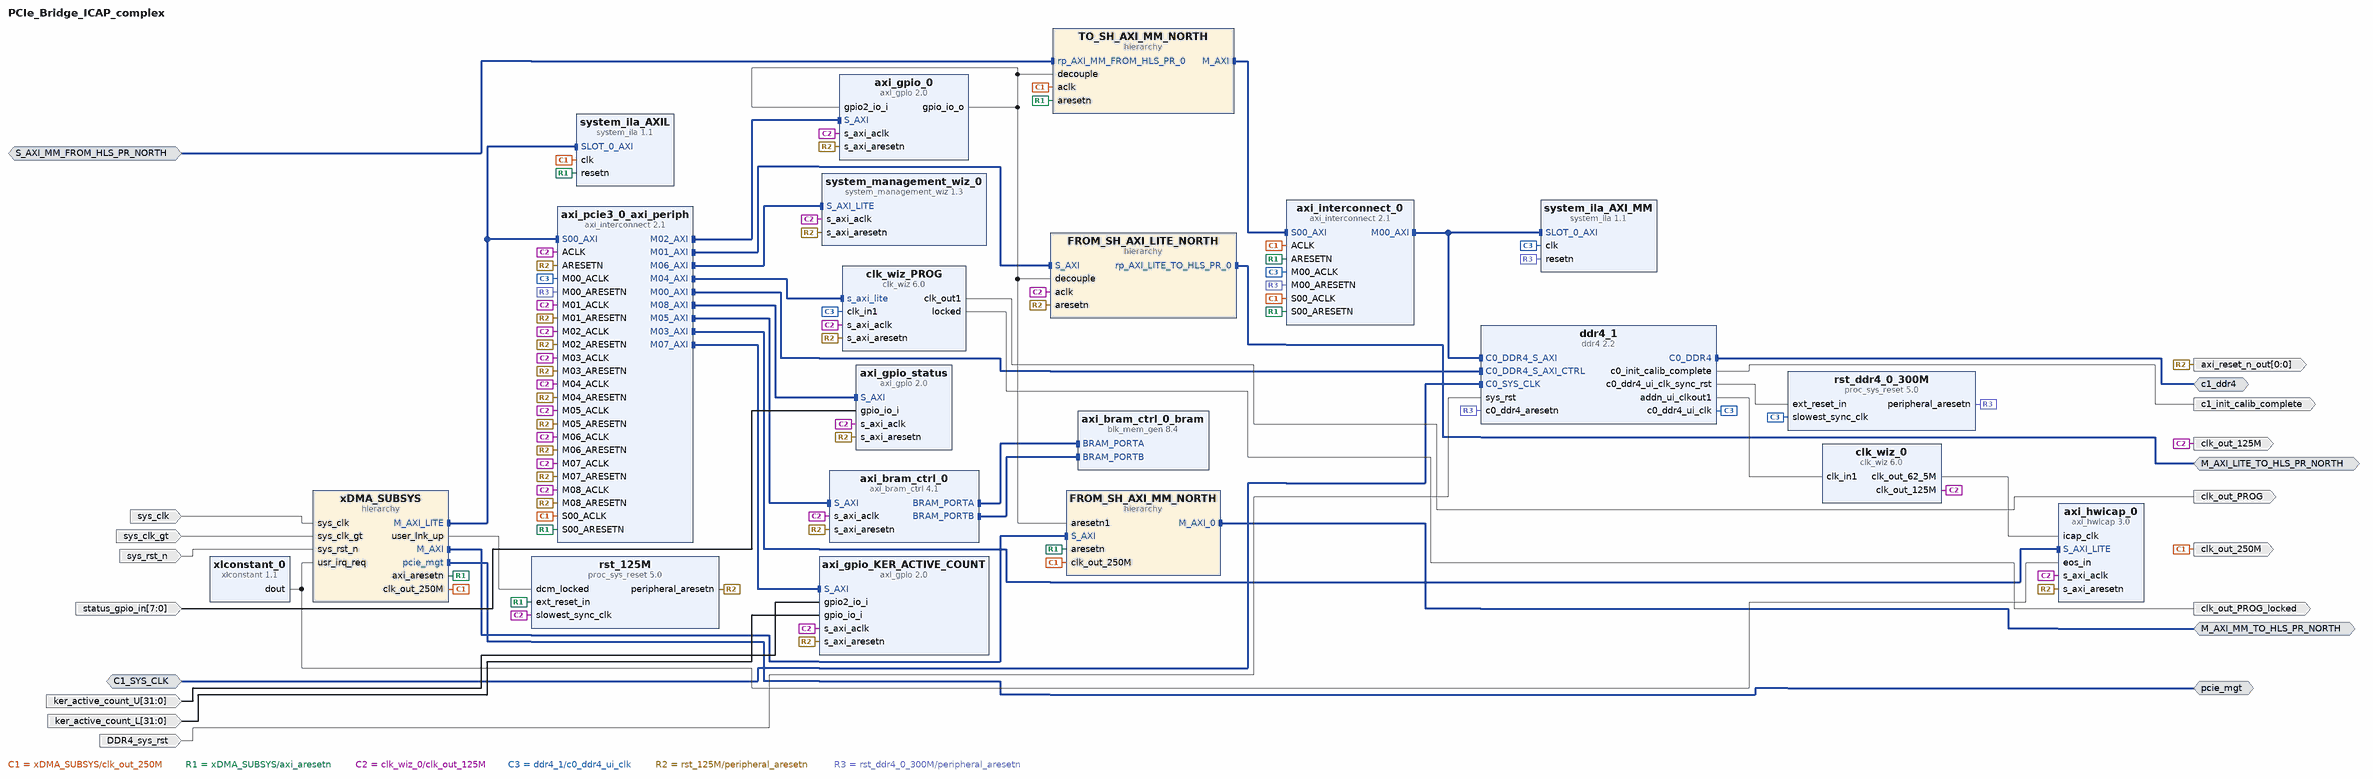
[diagram p0: block diagram of the top level]
# Vivado block design PCIe_Bridge_ICAP_complex, xcvu9p-fsgd2104-2-i, Vivado 2019.1
create_bd_design PCIe_Bridge_ICAP_complex

create_bd_intf_port -mode Slave -vlnv xilinx.com:interface:diff_clock_rtl:1.0 C1_SYS_CLK
set_property -dict {CONFIG.FREQ_HZ 300000000} [get_bd_intf_ports C1_SYS_CLK]
create_bd_intf_port -mode Master -vlnv xilinx.com:interface:aximm_rtl:1.0 M_AXI_LITE_TO_HLS_PR_NORTH
set_property -dict [list \
  CONFIG.ADDR_WIDTH 32 \
  CONFIG.DATA_WIDTH 32 \
  CONFIG.HAS_BURST 0 \
  CONFIG.HAS_QOS 0 \
  CONFIG.HAS_REGION 0 \
  CONFIG.PROTOCOL AXI4LITE \
] [get_bd_intf_ports M_AXI_LITE_TO_HLS_PR_NORTH]
create_bd_intf_port -mode Master -vlnv xilinx.com:interface:aximm_rtl:1.0 M_AXI_MM_TO_HLS_PR_NORTH
set_property -dict [list \
  CONFIG.ADDR_WIDTH 64 \
  CONFIG.DATA_WIDTH 512 \
  CONFIG.NUM_READ_OUTSTANDING 32 \
  CONFIG.NUM_WRITE_OUTSTANDING 32 \
  CONFIG.PROTOCOL AXI4 \
] [get_bd_intf_ports M_AXI_MM_TO_HLS_PR_NORTH]
create_bd_intf_port -mode Slave -vlnv xilinx.com:interface:aximm_rtl:1.0 S_AXI_MM_FROM_HLS_PR_NORTH
set_property -dict [list \
  CONFIG.ADDR_WIDTH 64 \
  CONFIG.ARUSER_WIDTH 0 \
  CONFIG.AWUSER_WIDTH 0 \
  CONFIG.BUSER_WIDTH 0 \
  CONFIG.DATA_WIDTH 512 \
  CONFIG.HAS_BRESP 1 \
  CONFIG.HAS_BURST 1 \
  CONFIG.HAS_CACHE 1 \
  CONFIG.HAS_LOCK 1 \
  CONFIG.HAS_PROT 1 \
  CONFIG.HAS_QOS 1 \
  CONFIG.HAS_REGION 1 \
  CONFIG.HAS_RRESP 1 \
  CONFIG.HAS_WSTRB 1 \
  CONFIG.ID_WIDTH 5 \
  CONFIG.MAX_BURST_LENGTH 256 \
  CONFIG.NUM_READ_OUTSTANDING 32 \
  CONFIG.NUM_READ_THREADS 1 \
  CONFIG.NUM_WRITE_OUTSTANDING 32 \
  CONFIG.NUM_WRITE_THREADS 1 \
  CONFIG.PROTOCOL AXI4 \
  CONFIG.READ_WRITE_MODE READ_WRITE \
  CONFIG.RUSER_BITS_PER_BYTE 0 \
  CONFIG.RUSER_WIDTH 0 \
  CONFIG.SUPPORTS_NARROW_BURST 1 \
  CONFIG.WUSER_BITS_PER_BYTE 0 \
  CONFIG.WUSER_WIDTH 0 \
] [get_bd_intf_ports S_AXI_MM_FROM_HLS_PR_NORTH]
create_bd_intf_port -mode Master -vlnv xilinx.com:interface:ddr4_rtl:1.0 c1_ddr4
create_bd_intf_port -mode Master -vlnv xilinx.com:interface:pcie_7x_mgt_rtl:1.0 pcie_mgt
create_bd_port -dir I -type rst DDR4_sys_rst
set_property -dict {CONFIG.POLARITY ACTIVE_HIGH} [get_bd_ports DDR4_sys_rst]
create_bd_port -dir O -from 0 -to 0 -type rst axi_reset_n_out
create_bd_port -dir O c1_init_calib_complete
create_bd_port -dir O -type clk clk_out_125M
set_property -dict [list \
  CONFIG.ASSOCIATED_BUSIF M_AXI_LITE_TO_HLS_PR_NORTH \
  CONFIG.ASSOCIATED_RESET axi_reset_n_out \
] [get_bd_ports clk_out_125M]
create_bd_port -dir O -type clk clk_out_250M
set_property -dict {CONFIG.ASSOCIATED_BUSIF S_AXI_MM_FROM_HLS_PR_NORTH:M_AXI_MM_TO_HLS_PR_NORTH} [get_bd_ports clk_out_250M]
create_bd_port -dir O -type clk clk_out_PROG
set_property -dict {CONFIG.FREQ_HZ 400000000} [get_bd_ports clk_out_PROG]
create_bd_port -dir O clk_out_PROG_locked
create_bd_port -dir I -from 31 -to 0 ker_active_count_L
create_bd_port -dir I -from 31 -to 0 ker_active_count_U
create_bd_port -dir I -from 7 -to 0 status_gpio_in
create_bd_port -dir I -type clk sys_clk
create_bd_port -dir I -type clk sys_clk_gt
create_bd_port -dir I -type rst sys_rst_n

create_bd_cell -type hier FROM_SH_AXI_LITE_NORTH
create_bd_cell -type hier FROM_SH_AXI_MM_NORTH
create_bd_cell -type hier TO_SH_AXI_MM_NORTH
create_bd_cell -type ip -vlnv xilinx.com:ip:axi_bram_ctrl:4.1 axi_bram_ctrl_0
create_bd_cell -type ip -vlnv xilinx.com:ip:blk_mem_gen:8.4 axi_bram_ctrl_0_bram
set_property -dict [list \
  CONFIG.Enable_B Use_ENB_Pin \
  CONFIG.Memory_Type True_Dual_Port_RAM \
  CONFIG.Port_B_Clock 100 \
  CONFIG.Port_B_Enable_Rate 100 \
  CONFIG.Port_B_Write_Rate 50 \
  CONFIG.Use_RSTB_Pin true \
] [get_bd_cells axi_bram_ctrl_0_bram]
create_bd_cell -type ip -vlnv xilinx.com:ip:axi_gpio:2.0 axi_gpio_0
set_property -dict [list \
  CONFIG.C_ALL_INPUTS_2 1 \
  CONFIG.C_ALL_OUTPUTS 1 \
  CONFIG.C_GPIO2_WIDTH 1 \
  CONFIG.C_GPIO_WIDTH 1 \
  CONFIG.C_IS_DUAL 1 \
] [get_bd_cells axi_gpio_0]
create_bd_cell -type ip -vlnv xilinx.com:ip:axi_gpio:2.0 axi_gpio_KER_ACTIVE_COUNT
set_property -dict {CONFIG.C_ALL_INPUTS 1 CONFIG.C_ALL_INPUTS_2 1 CONFIG.C_IS_DUAL 1} [get_bd_cells axi_gpio_KER_ACTIVE_COUNT]
create_bd_cell -type ip -vlnv xilinx.com:ip:axi_gpio:2.0 axi_gpio_status
set_property -dict {CONFIG.C_ALL_INPUTS 1 CONFIG.C_GPIO_WIDTH 8} [get_bd_cells axi_gpio_status]
create_bd_cell -type ip -vlnv xilinx.com:ip:axi_hwicap:3.0 axi_hwicap_0
set_property -dict {CONFIG.C_FAMILY kintexu} [get_bd_cells axi_hwicap_0]
create_bd_cell -type ip -vlnv xilinx.com:ip:axi_interconnect:2.1 axi_interconnect_0
set_property -dict [list \
  CONFIG.M00_HAS_DATA_FIFO 0 \
  CONFIG.M00_HAS_REGSLICE 4 \
  CONFIG.M01_HAS_REGSLICE 4 \
  CONFIG.NUM_MI 1 \
  CONFIG.NUM_SI 1 \
  CONFIG.S00_HAS_DATA_FIFO 0 \
  CONFIG.S00_HAS_REGSLICE 4 \
  CONFIG.S01_HAS_DATA_FIFO 0 \
  CONFIG.S01_HAS_REGSLICE 4 \
  CONFIG.S02_HAS_DATA_FIFO 0 \
  CONFIG.S02_HAS_REGSLICE 4 \
  CONFIG.S03_HAS_DATA_FIFO 0 \
  CONFIG.S03_HAS_REGSLICE 4 \
  CONFIG.SYNCHRONIZATION_STAGES 2 \
] [get_bd_cells axi_interconnect_0]
create_bd_cell -type ip -vlnv xilinx.com:ip:axi_interconnect:2.1 axi_pcie3_0_axi_periph
set_property -dict [list \
  CONFIG.M00_HAS_REGSLICE 4 \
  CONFIG.M01_HAS_REGSLICE 4 \
  CONFIG.M02_HAS_REGSLICE 4 \
  CONFIG.M03_HAS_REGSLICE 4 \
  CONFIG.M04_HAS_REGSLICE 4 \
  CONFIG.M05_HAS_REGSLICE 4 \
  CONFIG.M06_HAS_REGSLICE 4 \
  CONFIG.M07_HAS_REGSLICE 4 \
  CONFIG.M08_HAS_REGSLICE 4 \
  CONFIG.NUM_MI 9 \
  CONFIG.S00_HAS_REGSLICE 4 \
  CONFIG.SYNCHRONIZATION_STAGES 2 \
] [get_bd_cells axi_pcie3_0_axi_periph]
create_bd_cell -type ip -vlnv xilinx.com:ip:clk_wiz:6.0 clk_wiz_0
set_property -dict [list \
  CONFIG.CLKIN1_JITTER_PS 40.0 \
  CONFIG.CLKOUT1_DRIVES BUFG \
  CONFIG.CLKOUT1_JITTER 88.976 \
  CONFIG.CLKOUT1_PHASE_ERROR 71.064 \
  CONFIG.CLKOUT1_REQUESTED_OUT_FREQ 125.000 \
  CONFIG.CLKOUT2_DRIVES BUFG \
  CONFIG.CLKOUT2_JITTER 101.705 \
  CONFIG.CLKOUT2_PHASE_ERROR 71.064 \
  CONFIG.CLKOUT2_REQUESTED_OUT_FREQ 62.5 \
  CONFIG.CLKOUT2_USED true \
  CONFIG.CLKOUT3_DRIVES Buffer \
  CONFIG.CLKOUT3_JITTER 79.446 \
  CONFIG.CLKOUT3_PHASE_ERROR 72.667 \
  CONFIG.CLKOUT3_REQUESTED_OUT_FREQ 100.000 \
  CONFIG.CLKOUT3_USED false \
  CONFIG.CLKOUT4_DRIVES Buffer \
  CONFIG.CLKOUT5_DRIVES Buffer \
  CONFIG.CLKOUT6_DRIVES Buffer \
  CONFIG.CLKOUT7_DRIVES Buffer \
  CONFIG.CLK_OUT1_PORT clk_out_125M \
  CONFIG.CLK_OUT2_PORT clk_out_62_5M \
  CONFIG.CLK_OUT3_PORT clk_out3 \
  CONFIG.FEEDBACK_SOURCE FDBK_AUTO \
  CONFIG.JITTER_SEL Min_O_Jitter \
  CONFIG.MMCM_BANDWIDTH HIGH \
  CONFIG.MMCM_CLKFBOUT_MULT_F 6.250 \
  CONFIG.MMCM_CLKIN1_PERIOD 4.000 \
  CONFIG.MMCM_CLKIN2_PERIOD 10.0 \
  CONFIG.MMCM_CLKOUT0_DIVIDE_F 12.500 \
  CONFIG.MMCM_CLKOUT1_DIVIDE 25 \
  CONFIG.MMCM_CLKOUT2_DIVIDE 1 \
  CONFIG.MMCM_DIVCLK_DIVIDE 1 \
  CONFIG.NUM_OUT_CLKS 2 \
  CONFIG.PHASESHIFT_MODE WAVEFORM \
  CONFIG.PRIM_SOURCE No_buffer \
  CONFIG.SECONDARY_SOURCE Single_ended_clock_capable_pin \
  CONFIG.USE_FREQ_SYNTH true \
  CONFIG.USE_LOCKED false \
  CONFIG.USE_PHASE_ALIGNMENT false \
  CONFIG.USE_RESET false \
] [get_bd_cells clk_wiz_0]
create_bd_cell -type ip -vlnv xilinx.com:ip:clk_wiz:6.0 clk_wiz_PROG
set_property -dict [list \
  CONFIG.CLKIN1_JITTER_PS 33.330000000000005 \
  CONFIG.CLKOUT1_DRIVES Buffer \
  CONFIG.CLKOUT1_JITTER 71.763 \
  CONFIG.CLKOUT1_PHASE_ERROR 75.042 \
  CONFIG.CLKOUT1_REQUESTED_OUT_FREQ 400.000 \
  CONFIG.CLKOUT2_DRIVES Buffer \
  CONFIG.CLKOUT3_DRIVES Buffer \
  CONFIG.CLKOUT4_DRIVES Buffer \
  CONFIG.CLKOUT5_DRIVES Buffer \
  CONFIG.CLKOUT6_DRIVES Buffer \
  CONFIG.CLKOUT7_DRIVES Buffer \
  CONFIG.JITTER_SEL Min_O_Jitter \
  CONFIG.MMCM_BANDWIDTH HIGH \
  CONFIG.MMCM_CLKFBOUT_MULT_F 15.500 \
  CONFIG.MMCM_CLKIN1_PERIOD 3.333 \
  CONFIG.MMCM_CLKIN2_PERIOD 10.0 \
  CONFIG.MMCM_CLKOUT0_DIVIDE_F 3.875 \
  CONFIG.MMCM_DIVCLK_DIVIDE 3 \
  CONFIG.PRIM_SOURCE No_buffer \
  CONFIG.SECONDARY_SOURCE Single_ended_clock_capable_pin \
  CONFIG.USE_DYN_RECONFIG true \
  CONFIG.USE_PHASE_ALIGNMENT false \
] [get_bd_cells clk_wiz_PROG]
create_bd_cell -type ip -vlnv xilinx.com:ip:ddr4:2.2 ddr4_1
set_property -dict [list \
  CONFIG.ADDN_UI_CLKOUT1_FREQ_HZ 250 \
  CONFIG.C0.BANK_GROUP_WIDTH 2 \
  CONFIG.C0.CKE_WIDTH 1 \
  CONFIG.C0.CS_WIDTH 1 \
  CONFIG.C0.DDR4_AxiAddressWidth 34 \
  CONFIG.C0.DDR4_AxiDataWidth 512 \
  CONFIG.C0.DDR4_CasLatency 17 \
  CONFIG.C0.DDR4_CasWriteLatency 12 \
  CONFIG.C0.DDR4_DataWidth 72 \
  CONFIG.C0.DDR4_InputClockPeriod 3332 \
  CONFIG.C0.DDR4_MemoryPart MTA18ASF2G72PZ-2G3 \
  CONFIG.C0.DDR4_MemoryType RDIMMs \
  CONFIG.C0.DDR4_TimePeriod 833 \
  CONFIG.C0.ODT_WIDTH 1 \
] [get_bd_cells ddr4_1]
create_bd_cell -type ip -vlnv xilinx.com:ip:proc_sys_reset:5.0 rst_125M
create_bd_cell -type ip -vlnv xilinx.com:ip:proc_sys_reset:5.0 rst_ddr4_0_300M
create_bd_cell -type ip -vlnv xilinx.com:ip:system_ila:1.1 system_ila_AXIL
set_property -dict {CONFIG.C_MON_TYPE INTERFACE} [get_bd_cells system_ila_AXIL]
create_bd_cell -type ip -vlnv xilinx.com:ip:system_ila:1.1 system_ila_AXI_MM
set_property -dict [list \
  CONFIG.ALL_PROBE_SAME_MU true \
  CONFIG.C_INPUT_PIPE_STAGES 4 \
  CONFIG.C_MON_TYPE INTERFACE \
  CONFIG.C_SLOT_0_AXI_B_SEL_TRIG 0 \
  CONFIG.C_SLOT_0_AXI_R_SEL_TRIG 0 \
  CONFIG.C_SLOT_0_AXI_W_SEL_TRIG 0 \
  CONFIG.C_SLOT_0_MAX_RD_BURSTS 32 \
  CONFIG.C_SLOT_0_MAX_WR_BURSTS 32 \
  CONFIG.C_SLOT_0_TXN_CNTR_EN 0 \
] [get_bd_cells system_ila_AXI_MM]
create_bd_cell -type ip -vlnv xilinx.com:ip:system_management_wiz:1.3 system_management_wiz_0
set_property -dict [list \
  CONFIG.CHANNEL_ENABLE_VP_VN false \
  CONFIG.INTERFACE_SELECTION Enable_AXI \
  CONFIG.TEMPERATURE_ALARM_OT_TRIGGER 95.0 \
] [get_bd_cells system_management_wiz_0]
create_bd_cell -type hier xDMA_SUBSYS
create_bd_cell -type ip -vlnv xilinx.com:ip:xlconstant:1.1 xlconstant_0
set_property -dict {CONFIG.CONST_VAL 0} [get_bd_cells xlconstant_0]

# ---- hierarchy /FROM_SH_AXI_LITE_NORTH ----
current_bd_instance /FROM_SH_AXI_LITE_NORTH
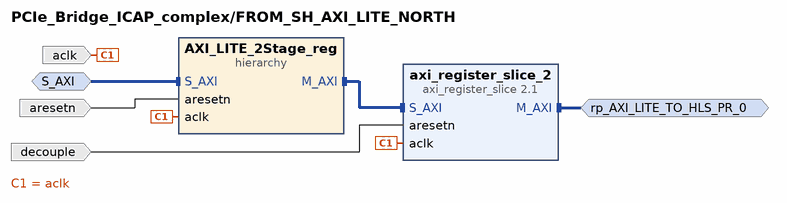
[diagram p1: block diagram inside /FROM_SH_AXI_LITE_NORTH]
create_bd_intf_pin -mode Slave -vlnv xilinx.com:interface:aximm_rtl:1.0 S_AXI
create_bd_intf_pin -mode Master -vlnv xilinx.com:interface:aximm_rtl:1.0 rp_AXI_LITE_TO_HLS_PR_0
create_bd_pin -dir I -type clk aclk
create_bd_pin -dir I -type rst aresetn
create_bd_pin -dir I decouple

create_bd_cell -type hier AXI_LITE_2Stage_reg
create_bd_cell -type ip -vlnv xilinx.com:ip:axi_register_slice:2.1 axi_register_slice_2
set_property -dict {CONFIG.REG_R 7 CONFIG.REG_W 7} [get_bd_cells axi_register_slice_2]

# ---- hierarchy /FROM_SH_AXI_LITE_NORTH/AXI_LITE_2Stage_reg ----
current_bd_instance /FROM_SH_AXI_LITE_NORTH/AXI_LITE_2Stage_reg
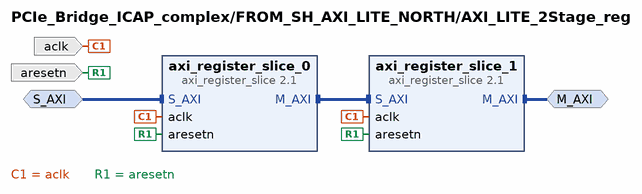
[diagram p2: block diagram inside /FROM_SH_AXI_LITE_NORTH/AXI_LITE_2Stage_reg]
create_bd_intf_pin -mode Master -vlnv xilinx.com:interface:aximm_rtl:1.0 M_AXI
create_bd_intf_pin -mode Slave -vlnv xilinx.com:interface:aximm_rtl:1.0 S_AXI
create_bd_pin -dir I -type clk aclk
create_bd_pin -dir I -type rst aresetn

create_bd_cell -type ip -vlnv xilinx.com:ip:axi_register_slice:2.1 axi_register_slice_0
set_property -dict {CONFIG.REG_R 7 CONFIG.REG_W 7} [get_bd_cells axi_register_slice_0]
create_bd_cell -type ip -vlnv xilinx.com:ip:axi_register_slice:2.1 axi_register_slice_1
set_property -dict {CONFIG.REG_R 7 CONFIG.REG_W 7} [get_bd_cells axi_register_slice_1]

# ---- hierarchy /FROM_SH_AXI_MM_NORTH ----
current_bd_instance /FROM_SH_AXI_MM_NORTH
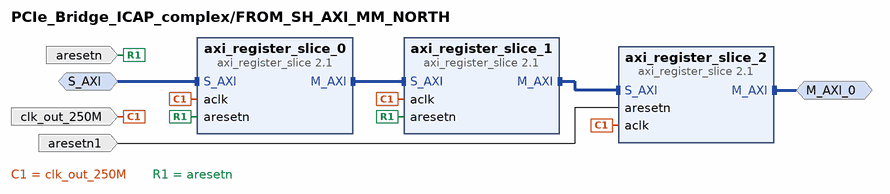
[diagram p3: block diagram inside /FROM_SH_AXI_MM_NORTH]
create_bd_intf_pin -mode Master -vlnv xilinx.com:interface:aximm_rtl:1.0 M_AXI_0
create_bd_intf_pin -mode Slave -vlnv xilinx.com:interface:aximm_rtl:1.0 S_AXI
create_bd_pin -dir I -type rst aresetn
create_bd_pin -dir I -type rst aresetn1
create_bd_pin -dir I -type clk clk_out_250M

create_bd_cell -type ip -vlnv xilinx.com:ip:axi_register_slice:2.1 axi_register_slice_0
create_bd_cell -type ip -vlnv xilinx.com:ip:axi_register_slice:2.1 axi_register_slice_1
create_bd_cell -type ip -vlnv xilinx.com:ip:axi_register_slice:2.1 axi_register_slice_2

# ---- hierarchy /TO_SH_AXI_MM_NORTH ----
current_bd_instance /TO_SH_AXI_MM_NORTH
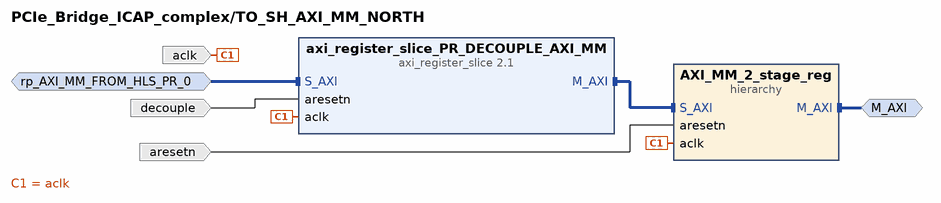
[diagram p4: block diagram inside /TO_SH_AXI_MM_NORTH]
create_bd_intf_pin -mode Master -vlnv xilinx.com:interface:aximm_rtl:1.0 M_AXI
create_bd_intf_pin -mode Slave -vlnv xilinx.com:interface:aximm_rtl:1.0 rp_AXI_MM_FROM_HLS_PR_0
create_bd_pin -dir I -type clk aclk
create_bd_pin -dir I -type rst aresetn
create_bd_pin -dir I decouple

create_bd_cell -type hier AXI_MM_2_stage_reg
create_bd_cell -type ip -vlnv xilinx.com:ip:axi_register_slice:2.1 axi_register_slice_PR_DECOUPLE_AXI_MM

# ---- hierarchy /TO_SH_AXI_MM_NORTH/AXI_MM_2_stage_reg ----
current_bd_instance /TO_SH_AXI_MM_NORTH/AXI_MM_2_stage_reg
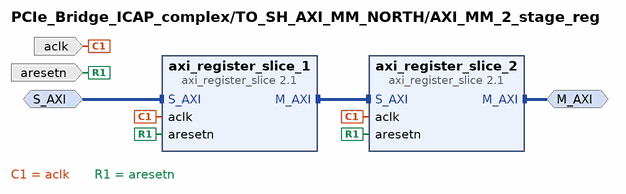
[diagram p5: block diagram inside /TO_SH_AXI_MM_NORTH/AXI_MM_2_stage_reg]
create_bd_intf_pin -mode Master -vlnv xilinx.com:interface:aximm_rtl:1.0 M_AXI
create_bd_intf_pin -mode Slave -vlnv xilinx.com:interface:aximm_rtl:1.0 S_AXI
create_bd_pin -dir I -type clk aclk
create_bd_pin -dir I -type rst aresetn

create_bd_cell -type ip -vlnv xilinx.com:ip:axi_register_slice:2.1 axi_register_slice_1
create_bd_cell -type ip -vlnv xilinx.com:ip:axi_register_slice:2.1 axi_register_slice_2

# ---- hierarchy /xDMA_SUBSYS ----
current_bd_instance /xDMA_SUBSYS
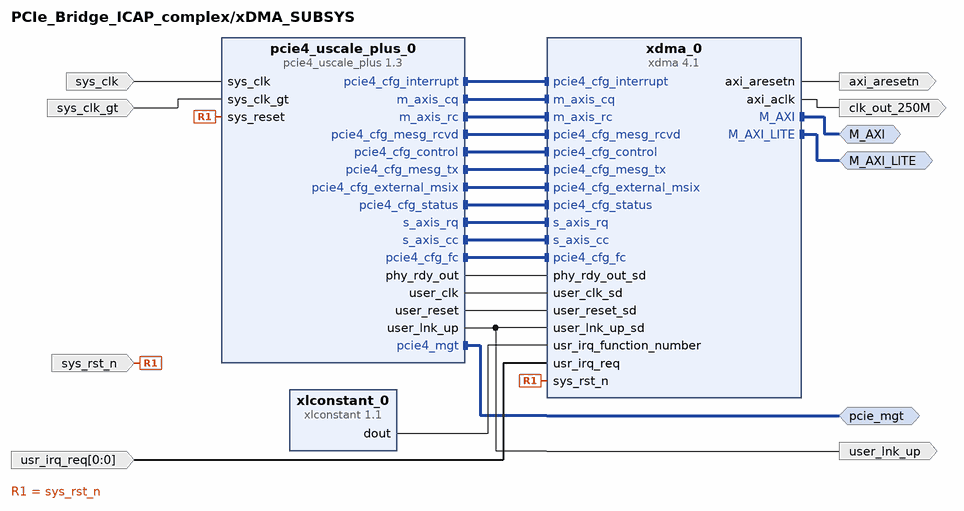
[diagram p6: block diagram inside /xDMA_SUBSYS]
create_bd_intf_pin -mode Master -vlnv xilinx.com:interface:aximm_rtl:1.0 M_AXI
create_bd_intf_pin -mode Master -vlnv xilinx.com:interface:aximm_rtl:1.0 M_AXI_LITE
create_bd_intf_pin -mode Master -vlnv xilinx.com:interface:pcie_7x_mgt_rtl:1.0 pcie_mgt
create_bd_pin -dir O -type rst axi_aresetn
create_bd_pin -dir O -type clk clk_out_250M
create_bd_pin -dir I -type clk sys_clk
create_bd_pin -dir I -type clk sys_clk_gt
create_bd_pin -dir I -type rst sys_rst_n
create_bd_pin -dir O user_lnk_up
create_bd_pin -dir I -from 0 -to 0 usr_irq_req

create_bd_cell -type ip -vlnv xilinx.com:ip:pcie4_uscale_plus:1.3 pcie4_uscale_plus_0
set_property -dict [list \
  CONFIG.AXISTEN_IF_CQ_ALIGNMENT_MODE Address_Aligned \
  CONFIG.AXISTEN_IF_EXT_512_RC_4TLP_STRADDLE true \
  CONFIG.AXISTEN_IF_EXT_512_RQ_STRADDLE true \
  CONFIG.MSI_X_OPTIONS MSI-X_External \
  CONFIG.PF0_DEVICE_ID 903F \
  CONFIG.PF0_MSIX_CAP_PBA_BIR BAR_1 \
  CONFIG.PF0_MSIX_CAP_PBA_OFFSET 00008FE0 \
  CONFIG.PF0_MSIX_CAP_TABLE_BIR BAR_1 \
  CONFIG.PF0_MSIX_CAP_TABLE_OFFSET 00008000 \
  CONFIG.PF0_MSIX_CAP_TABLE_SIZE 020 \
  CONFIG.PF1_DEVICE_ID 9040 \
  CONFIG.PF1_MSIX_CAP_PBA_BIR BAR_1 \
  CONFIG.PF1_MSIX_CAP_PBA_OFFSET 9FE0 \
  CONFIG.PF1_MSIX_CAP_TABLE_BIR BAR_1 \
  CONFIG.PF1_MSIX_CAP_TABLE_OFFSET 9000 \
  CONFIG.PF1_MSIX_CAP_TABLE_SIZE 020 \
  CONFIG.PF2_DEVICE_ID 0007 \
  CONFIG.PF3_DEVICE_ID 903F \
  CONFIG.PL_DISABLE_LANE_REVERSAL TRUE \
  CONFIG.PL_LINK_CAP_MAX_LINK_SPEED 8.0_GT/s \
  CONFIG.PL_LINK_CAP_MAX_LINK_WIDTH X16 \
  CONFIG.TL_PF_ENABLE_REG 2 \
  CONFIG.acs_ext_cap_enable true \
  CONFIG.axisten_freq 250 \
  CONFIG.axisten_if_enable_client_tag true \
  CONFIG.axisten_if_width 512_bit \
  CONFIG.cfg_mgmt_if false \
  CONFIG.cfg_pm_if false \
  CONFIG.gen_x0y1 false \
  CONFIG.mcap_enablement None \
  CONFIG.mode_selection Advanced \
  CONFIG.pcie_blk_locn X1Y2 \
  CONFIG.pf0_bar0_scale Megabytes \
  CONFIG.pf0_bar0_size 32 \
  CONFIG.pf0_bar1_enabled true \
  CONFIG.pf0_bar1_size 128 \
  CONFIG.pf0_bar1_type Memory \
  CONFIG.pf0_base_class_menu Simple_communication_controllers \
  CONFIG.pf0_class_code_base 07 \
  CONFIG.pf0_class_code_interface 01 \
  CONFIG.pf0_class_code_sub 00 \
  CONFIG.pf0_msi_enabled false \
  CONFIG.pf0_msix_enabled true \
  CONFIG.pf0_sub_class_interface_menu 16450_compatible_serial_controller \
  CONFIG.pf1_base_class_menu Simple_communication_controllers \
  CONFIG.pf1_class_code_base 07 \
  CONFIG.pf1_class_code_interface 01 \
  CONFIG.pf1_class_code_sub 00 \
  CONFIG.pf1_msix_enabled true \
  CONFIG.pf1_sub_class_interface_menu 16450_compatible_serial_controller \
  CONFIG.plltype QPLL1 \
] [get_bd_cells pcie4_uscale_plus_0]
create_bd_cell -type ip -vlnv xilinx.com:ip:xdma:4.1 xdma_0
set_property -dict [list \
  CONFIG.PF0_DEVICE_ID_mqdma 903F \
  CONFIG.PF2_DEVICE_ID_mqdma 903F \
  CONFIG.PF3_DEVICE_ID_mqdma 903F \
  CONFIG.acs_ext_cap_enable true \
  CONFIG.axi_bypass_64bit_en false \
  CONFIG.axi_data_width 512_bit \
  CONFIG.axil_master_64bit_en false \
  CONFIG.axilite_master_en true \
  CONFIG.axilite_master_scale Megabytes \
  CONFIG.axilite_master_size 32 \
  CONFIG.axisten_freq 250 \
  CONFIG.c_s_axi_num_read 32 \
  CONFIG.cfg_mgmt_if false \
  CONFIG.en_axi_slave_if false \
  CONFIG.mode_selection Advanced \
  CONFIG.pcie_blk_locn X1Y2 \
  CONFIG.pcie_id_if FALSE \
  CONFIG.pciebar2axibar_axil_master 0x0000000000000000 \
  CONFIG.pf0_device_id 903F \
  CONFIG.pf0_interrupt_pin NONE \
  CONFIG.pf0_msi_enabled false \
  CONFIG.pf0_msix_cap_pba_bir BAR_1 \
  CONFIG.pf0_msix_cap_pba_offset 00008FE0 \
  CONFIG.pf0_msix_cap_table_bir BAR_1 \
  CONFIG.pf0_msix_cap_table_offset 00008000 \
  CONFIG.pf0_msix_cap_table_size 01F \
  CONFIG.pf0_msix_enabled true \
  CONFIG.pf1_bar0_scale Kilobytes \
  CONFIG.pf1_bar0_size 128 \
  CONFIG.pf1_bar1_enabled false \
  CONFIG.pipe_sim false \
  CONFIG.pl_link_cap_max_link_speed 8.0_GT/s \
  CONFIG.pl_link_cap_max_link_width X16 \
  CONFIG.plltype QPLL1 \
  CONFIG.split_dma true \
  CONFIG.xdma_pcie_64bit_en false \
] [get_bd_cells xdma_0]
create_bd_cell -type ip -vlnv xilinx.com:ip:xlconstant:1.1 xlconstant_0
set_property -dict {CONFIG.CONST_VAL 2 CONFIG.CONST_WIDTH 2} [get_bd_cells xlconstant_0]

# ---- connections ----

current_bd_instance /FROM_SH_AXI_LITE_NORTH
connect_bd_intf_net [get_bd_intf_pins AXI_LITE_2Stage_reg/M_AXI] [get_bd_intf_pins axi_register_slice_2/S_AXI]
connect_bd_intf_net [get_bd_intf_pins rp_AXI_LITE_TO_HLS_PR_0] [get_bd_intf_pins axi_register_slice_2/M_AXI]
connect_bd_intf_net [get_bd_intf_pins S_AXI] [get_bd_intf_pins AXI_LITE_2Stage_reg/S_AXI]
connect_bd_net -net clk_wiz_0_clk_out_125M [get_bd_pins aclk] [get_bd_pins AXI_LITE_2Stage_reg/aclk] [get_bd_pins axi_register_slice_2/aclk]
connect_bd_net [get_bd_pins decouple] [get_bd_pins axi_register_slice_2/aresetn]
connect_bd_net -net rst_ddr4_0_300M1_peripheral_aresetn [get_bd_pins aresetn] [get_bd_pins AXI_LITE_2Stage_reg/aresetn]

current_bd_instance /FROM_SH_AXI_LITE_NORTH/AXI_LITE_2Stage_reg
connect_bd_intf_net [get_bd_intf_pins M_AXI] [get_bd_intf_pins axi_register_slice_1/M_AXI]
connect_bd_intf_net [get_bd_intf_pins axi_register_slice_0/M_AXI] [get_bd_intf_pins axi_register_slice_1/S_AXI]
connect_bd_intf_net [get_bd_intf_pins S_AXI] [get_bd_intf_pins axi_register_slice_0/S_AXI]
connect_bd_net [get_bd_pins aclk] [get_bd_pins axi_register_slice_0/aclk] [get_bd_pins axi_register_slice_1/aclk]
connect_bd_net [get_bd_pins aresetn] [get_bd_pins axi_register_slice_0/aresetn] [get_bd_pins axi_register_slice_1/aresetn]

current_bd_instance /FROM_SH_AXI_MM_NORTH
connect_bd_intf_net [get_bd_intf_pins axi_register_slice_1/M_AXI] [get_bd_intf_pins axi_register_slice_2/S_AXI]
connect_bd_intf_net [get_bd_intf_pins axi_register_slice_0/M_AXI] [get_bd_intf_pins axi_register_slice_1/S_AXI]
connect_bd_intf_net [get_bd_intf_pins S_AXI] [get_bd_intf_pins axi_register_slice_0/S_AXI]
connect_bd_intf_net [get_bd_intf_pins M_AXI_0] [get_bd_intf_pins axi_register_slice_2/M_AXI]
connect_bd_net -net axi_pcie3_0_axi_aclk [get_bd_pins clk_out_250M] \
  [get_bd_pins axi_register_slice_0/aclk] [get_bd_pins axi_register_slice_1/aclk] [get_bd_pins axi_register_slice_2/aclk]
connect_bd_net -net axi_pcie3_0_axi_aresetn [get_bd_pins aresetn] \
  [get_bd_pins axi_register_slice_0/aresetn] [get_bd_pins axi_register_slice_1/aresetn]
connect_bd_net -net xlslice_0_Dout [get_bd_pins aresetn1] [get_bd_pins axi_register_slice_2/aresetn]

current_bd_instance /TO_SH_AXI_MM_NORTH
connect_bd_intf_net [get_bd_intf_pins M_AXI] [get_bd_intf_pins AXI_MM_2_stage_reg/M_AXI]
connect_bd_intf_net [get_bd_intf_pins AXI_MM_2_stage_reg/S_AXI] [get_bd_intf_pins axi_register_slice_PR_DECOUPLE_AXI_MM/M_AXI]
connect_bd_intf_net [get_bd_intf_pins rp_AXI_MM_FROM_HLS_PR_0] [get_bd_intf_pins axi_register_slice_PR_DECOUPLE_AXI_MM/S_AXI]
connect_bd_net -net clk_wiz_0_clk_out_125M [get_bd_pins aclk] \
  [get_bd_pins AXI_MM_2_stage_reg/aclk] [get_bd_pins axi_register_slice_PR_DECOUPLE_AXI_MM/aclk]
connect_bd_net [get_bd_pins decouple] [get_bd_pins axi_register_slice_PR_DECOUPLE_AXI_MM/aresetn]
connect_bd_net -net rst_ddr4_0_300M1_peripheral_aresetn [get_bd_pins aresetn] [get_bd_pins AXI_MM_2_stage_reg/aresetn]

current_bd_instance /TO_SH_AXI_MM_NORTH/AXI_MM_2_stage_reg
connect_bd_intf_net [get_bd_intf_pins M_AXI] [get_bd_intf_pins axi_register_slice_2/M_AXI]
connect_bd_intf_net [get_bd_intf_pins S_AXI] [get_bd_intf_pins axi_register_slice_1/S_AXI]
connect_bd_intf_net [get_bd_intf_pins axi_register_slice_1/M_AXI] [get_bd_intf_pins axi_register_slice_2/S_AXI]
connect_bd_net -net axi_pcie3_0_axi_aclk [get_bd_pins aclk] [get_bd_pins axi_register_slice_1/aclk] [get_bd_pins axi_register_slice_2/aclk]
connect_bd_net -net axi_pcie3_0_axi_aresetn [get_bd_pins aresetn] \
  [get_bd_pins axi_register_slice_1/aresetn] [get_bd_pins axi_register_slice_2/aresetn]

current_bd_instance /xDMA_SUBSYS
connect_bd_intf_net [get_bd_intf_pins pcie4_uscale_plus_0/pcie4_cfg_interrupt] [get_bd_intf_pins xdma_0/pcie4_cfg_interrupt]
connect_bd_intf_net [get_bd_intf_pins pcie4_uscale_plus_0/m_axis_cq] [get_bd_intf_pins xdma_0/m_axis_cq]
connect_bd_intf_net [get_bd_intf_pins pcie4_uscale_plus_0/m_axis_rc] [get_bd_intf_pins xdma_0/m_axis_rc]
connect_bd_intf_net [get_bd_intf_pins M_AXI_LITE] [get_bd_intf_pins xdma_0/M_AXI_LITE]
connect_bd_intf_net [get_bd_intf_pins pcie4_uscale_plus_0/pcie4_cfg_mesg_rcvd] [get_bd_intf_pins xdma_0/pcie4_cfg_mesg_rcvd]
connect_bd_intf_net [get_bd_intf_pins pcie4_uscale_plus_0/pcie4_cfg_control] [get_bd_intf_pins xdma_0/pcie4_cfg_control]
connect_bd_intf_net [get_bd_intf_pins M_AXI] [get_bd_intf_pins xdma_0/M_AXI]
connect_bd_intf_net [get_bd_intf_pins pcie4_uscale_plus_0/pcie4_cfg_mesg_tx] [get_bd_intf_pins xdma_0/pcie4_cfg_mesg_tx]
connect_bd_intf_net [get_bd_intf_pins pcie4_uscale_plus_0/pcie4_cfg_external_msix] [get_bd_intf_pins xdma_0/pcie4_cfg_external_msix]
connect_bd_intf_net [get_bd_intf_pins pcie4_uscale_plus_0/pcie4_cfg_status] [get_bd_intf_pins xdma_0/pcie4_cfg_status]
connect_bd_intf_net [get_bd_intf_pins pcie4_uscale_plus_0/s_axis_rq] [get_bd_intf_pins xdma_0/s_axis_rq]
connect_bd_intf_net [get_bd_intf_pins pcie_mgt] [get_bd_intf_pins pcie4_uscale_plus_0/pcie4_mgt]
connect_bd_intf_net [get_bd_intf_pins pcie4_uscale_plus_0/s_axis_cc] [get_bd_intf_pins xdma_0/s_axis_cc]
connect_bd_intf_net [get_bd_intf_pins pcie4_uscale_plus_0/pcie4_cfg_fc] [get_bd_intf_pins xdma_0/pcie4_cfg_fc]
connect_bd_net -net axi_pcie3_0_axi_aclk [get_bd_pins xdma_0/axi_aclk] [get_bd_pins clk_out_250M]
connect_bd_net -net axi_pcie3_0_axi_aresetn [get_bd_pins xdma_0/axi_aresetn] [get_bd_pins axi_aresetn]
connect_bd_net [get_bd_pins pcie4_uscale_plus_0/phy_rdy_out] [get_bd_pins xdma_0/phy_rdy_out_sd]
connect_bd_net [get_bd_pins pcie4_uscale_plus_0/user_clk] [get_bd_pins xdma_0/user_clk_sd]
connect_bd_net [get_bd_pins pcie4_uscale_plus_0/user_reset] [get_bd_pins xdma_0/user_reset_sd]
connect_bd_net [get_bd_pins sys_clk] [get_bd_pins pcie4_uscale_plus_0/sys_clk]
connect_bd_net [get_bd_pins sys_clk_gt] [get_bd_pins pcie4_uscale_plus_0/sys_clk_gt]
connect_bd_net [get_bd_pins sys_rst_n] [get_bd_pins pcie4_uscale_plus_0/sys_reset] [get_bd_pins xdma_0/sys_rst_n]
connect_bd_net -net xdma_0_user_lnk_up [get_bd_pins pcie4_uscale_plus_0/user_lnk_up] [get_bd_pins user_lnk_up] [get_bd_pins xdma_0/user_lnk_up_sd]
connect_bd_net -net xlconstant_0_dout [get_bd_pins usr_irq_req] [get_bd_pins xdma_0/usr_irq_req]
connect_bd_net [get_bd_pins xlconstant_0/dout] [get_bd_pins xdma_0/usr_irq_function_number]

current_bd_instance /
connect_bd_intf_net [get_bd_intf_ports S_AXI_MM_FROM_HLS_PR_NORTH] [get_bd_intf_pins TO_SH_AXI_MM_NORTH/rp_AXI_MM_FROM_HLS_PR_0]
connect_bd_intf_net [get_bd_intf_pins axi_bram_ctrl_0/BRAM_PORTA] [get_bd_intf_pins axi_bram_ctrl_0_bram/BRAM_PORTA]
connect_bd_intf_net [get_bd_intf_pins FROM_SH_AXI_LITE_NORTH/S_AXI] [get_bd_intf_pins axi_pcie3_0_axi_periph/M01_AXI]
connect_bd_intf_net [get_bd_intf_ports C1_SYS_CLK] [get_bd_intf_pins ddr4_1/C0_SYS_CLK]
connect_bd_intf_net [get_bd_intf_pins axi_interconnect_0/M00_AXI] [get_bd_intf_pins ddr4_1/C0_DDR4_S_AXI]
connect_bd_intf_net [get_bd_intf_pins axi_interconnect_0/M00_AXI] [get_bd_intf_pins system_ila_AXI_MM/SLOT_0_AXI]
connect_bd_intf_net [get_bd_intf_pins axi_pcie3_0_axi_periph/S00_AXI] [get_bd_intf_pins xDMA_SUBSYS/M_AXI_LITE]
connect_bd_intf_net [get_bd_intf_pins axi_pcie3_0_axi_periph/S00_AXI] [get_bd_intf_pins system_ila_AXIL/SLOT_0_AXI]
connect_bd_intf_net [get_bd_intf_ports M_AXI_LITE_TO_HLS_PR_NORTH] [get_bd_intf_pins FROM_SH_AXI_LITE_NORTH/rp_AXI_LITE_TO_HLS_PR_0]
connect_bd_intf_net [get_bd_intf_ports c1_ddr4] [get_bd_intf_pins ddr4_1/C0_DDR4]
connect_bd_intf_net [get_bd_intf_ports M_AXI_MM_TO_HLS_PR_NORTH] [get_bd_intf_pins FROM_SH_AXI_MM_NORTH/M_AXI_0]
connect_bd_intf_net [get_bd_intf_ports pcie_mgt] [get_bd_intf_pins xDMA_SUBSYS/pcie_mgt]
connect_bd_intf_net [get_bd_intf_pins axi_pcie3_0_axi_periph/M04_AXI] [get_bd_intf_pins clk_wiz_PROG/s_axi_lite]
connect_bd_intf_net [get_bd_intf_pins axi_gpio_status/S_AXI] [get_bd_intf_pins axi_pcie3_0_axi_periph/M08_AXI]
connect_bd_intf_net [get_bd_intf_pins axi_bram_ctrl_0/BRAM_PORTB] [get_bd_intf_pins axi_bram_ctrl_0_bram/BRAM_PORTB]
connect_bd_intf_net [get_bd_intf_pins axi_gpio_KER_ACTIVE_COUNT/S_AXI] [get_bd_intf_pins axi_pcie3_0_axi_periph/M07_AXI]
connect_bd_intf_net [get_bd_intf_pins axi_pcie3_0_axi_periph/M00_AXI] [get_bd_intf_pins ddr4_1/C0_DDR4_S_AXI_CTRL]
connect_bd_intf_net [get_bd_intf_pins TO_SH_AXI_MM_NORTH/M_AXI] [get_bd_intf_pins axi_interconnect_0/S00_AXI]
connect_bd_intf_net [get_bd_intf_pins axi_gpio_0/S_AXI] [get_bd_intf_pins axi_pcie3_0_axi_periph/M02_AXI]
connect_bd_intf_net [get_bd_intf_pins axi_pcie3_0_axi_periph/M06_AXI] [get_bd_intf_pins system_management_wiz_0/S_AXI_LITE]
connect_bd_intf_net [get_bd_intf_pins axi_bram_ctrl_0/S_AXI] [get_bd_intf_pins axi_pcie3_0_axi_periph/M05_AXI]
connect_bd_intf_net [get_bd_intf_pins FROM_SH_AXI_MM_NORTH/S_AXI] [get_bd_intf_pins xDMA_SUBSYS/M_AXI]
connect_bd_intf_net [get_bd_intf_pins axi_hwicap_0/S_AXI_LITE] [get_bd_intf_pins axi_pcie3_0_axi_periph/M03_AXI]
connect_bd_net -net axi_pcie3_0_axi_aclk [get_bd_pins xDMA_SUBSYS/clk_out_250M] \
  [get_bd_ports clk_out_250M] [get_bd_pins FROM_SH_AXI_MM_NORTH/clk_out_250M] [get_bd_pins TO_SH_AXI_MM_NORTH/aclk] \
  [get_bd_pins axi_interconnect_0/ACLK] [get_bd_pins axi_interconnect_0/S00_ACLK] \
  [get_bd_pins axi_pcie3_0_axi_periph/S00_ACLK] [get_bd_pins system_ila_AXIL/clk]
connect_bd_net -net axi_pcie3_0_axi_aresetn [get_bd_pins xDMA_SUBSYS/axi_aresetn] \
  [get_bd_pins FROM_SH_AXI_MM_NORTH/aresetn] [get_bd_pins TO_SH_AXI_MM_NORTH/aresetn] \
  [get_bd_pins axi_interconnect_0/ARESETN] [get_bd_pins axi_interconnect_0/S00_ARESETN] \
  [get_bd_pins axi_pcie3_0_axi_periph/S00_ARESETN] [get_bd_pins rst_125M/ext_reset_in] [get_bd_pins system_ila_AXIL/resetn]
connect_bd_net [get_bd_pins clk_wiz_0/clk_out_125M] \
  [get_bd_ports clk_out_125M] [get_bd_pins FROM_SH_AXI_LITE_NORTH/aclk] [get_bd_pins axi_bram_ctrl_0/s_axi_aclk] \
  [get_bd_pins axi_gpio_0/s_axi_aclk] [get_bd_pins axi_gpio_KER_ACTIVE_COUNT/s_axi_aclk] \
  [get_bd_pins axi_gpio_status/s_axi_aclk] [get_bd_pins axi_hwicap_0/s_axi_aclk] [get_bd_pins axi_pcie3_0_axi_periph/ACLK] \
  [get_bd_pins axi_pcie3_0_axi_periph/M01_ACLK] [get_bd_pins axi_pcie3_0_axi_periph/M02_ACLK] \
  [get_bd_pins axi_pcie3_0_axi_periph/M03_ACLK] [get_bd_pins axi_pcie3_0_axi_periph/M04_ACLK] \
  [get_bd_pins axi_pcie3_0_axi_periph/M05_ACLK] [get_bd_pins axi_pcie3_0_axi_periph/M06_ACLK] \
  [get_bd_pins axi_pcie3_0_axi_periph/M07_ACLK] [get_bd_pins axi_pcie3_0_axi_periph/M08_ACLK] \
  [get_bd_pins clk_wiz_PROG/s_axi_aclk] [get_bd_pins rst_125M/slowest_sync_clk] \
  [get_bd_pins system_management_wiz_0/s_axi_aclk]
connect_bd_net [get_bd_pins clk_wiz_0/clk_out_62_5M] [get_bd_pins axi_hwicap_0/icap_clk]
connect_bd_net -net clk_wiz_1_clk_out1 [get_bd_pins clk_wiz_PROG/clk_out1] [get_bd_ports clk_out_PROG]
connect_bd_net [get_bd_pins clk_wiz_PROG/locked] [get_bd_ports clk_out_PROG_locked]
connect_bd_net -net ddr4_0_c0_ddr4_ui_clk [get_bd_pins ddr4_1/c0_ddr4_ui_clk] \
  [get_bd_pins axi_interconnect_0/M00_ACLK] [get_bd_pins axi_pcie3_0_axi_periph/M00_ACLK] [get_bd_pins clk_wiz_PROG/clk_in1] \
  [get_bd_pins rst_ddr4_0_300M/slowest_sync_clk] [get_bd_pins system_ila_AXI_MM/clk]
connect_bd_net -net ddr4_0_c0_ddr4_ui_clk_sync_rst [get_bd_pins ddr4_1/c0_ddr4_ui_clk_sync_rst] [get_bd_pins rst_ddr4_0_300M/ext_reset_in]
connect_bd_net [get_bd_pins ddr4_1/addn_ui_clkout1] [get_bd_pins clk_wiz_0/clk_in1]
connect_bd_net [get_bd_pins ddr4_1/c0_init_calib_complete] [get_bd_ports c1_init_calib_complete]
connect_bd_net -net gpio2_io_i_0_1 [get_bd_ports ker_active_count_U] [get_bd_pins axi_gpio_KER_ACTIVE_COUNT/gpio2_io_i]
connect_bd_net -net gpio_io_i_0_1 [get_bd_ports ker_active_count_L] [get_bd_pins axi_gpio_KER_ACTIVE_COUNT/gpio_io_i]
connect_bd_net -net gpio_io_i_0_2 [get_bd_ports status_gpio_in] [get_bd_pins axi_gpio_status/gpio_io_i]
connect_bd_net -net rst_ddr4_0_300M1_peripheral_aresetn [get_bd_pins rst_125M/peripheral_aresetn] \
  [get_bd_ports axi_reset_n_out] [get_bd_pins FROM_SH_AXI_LITE_NORTH/aresetn] [get_bd_pins axi_bram_ctrl_0/s_axi_aresetn] \
  [get_bd_pins axi_gpio_0/s_axi_aresetn] [get_bd_pins axi_gpio_KER_ACTIVE_COUNT/s_axi_aresetn] \
  [get_bd_pins axi_gpio_status/s_axi_aresetn] [get_bd_pins axi_hwicap_0/s_axi_aresetn] \
  [get_bd_pins axi_pcie3_0_axi_periph/ARESETN] [get_bd_pins axi_pcie3_0_axi_periph/M01_ARESETN] \
  [get_bd_pins axi_pcie3_0_axi_periph/M02_ARESETN] [get_bd_pins axi_pcie3_0_axi_periph/M03_ARESETN] \
  [get_bd_pins axi_pcie3_0_axi_periph/M04_ARESETN] [get_bd_pins axi_pcie3_0_axi_periph/M05_ARESETN] \
  [get_bd_pins axi_pcie3_0_axi_periph/M06_ARESETN] [get_bd_pins axi_pcie3_0_axi_periph/M07_ARESETN] \
  [get_bd_pins axi_pcie3_0_axi_periph/M08_ARESETN] [get_bd_pins clk_wiz_PROG/s_axi_aresetn] \
  [get_bd_pins system_management_wiz_0/s_axi_aresetn]
connect_bd_net [get_bd_pins rst_ddr4_0_300M/peripheral_aresetn] \
  [get_bd_pins axi_interconnect_0/M00_ARESETN] [get_bd_pins axi_pcie3_0_axi_periph/M00_ARESETN] \
  [get_bd_pins ddr4_1/c0_ddr4_aresetn] [get_bd_pins system_ila_AXI_MM/resetn]
connect_bd_net [get_bd_ports sys_clk] [get_bd_pins xDMA_SUBSYS/sys_clk]
connect_bd_net [get_bd_ports sys_clk_gt] [get_bd_pins xDMA_SUBSYS/sys_clk_gt]
connect_bd_net -net sys_rst_1 [get_bd_ports DDR4_sys_rst] [get_bd_pins ddr4_1/sys_rst]
connect_bd_net [get_bd_ports sys_rst_n] [get_bd_pins xDMA_SUBSYS/sys_rst_n]
connect_bd_net -net xdma_0_user_lnk_up [get_bd_pins xDMA_SUBSYS/user_lnk_up] [get_bd_pins rst_125M/dcm_locked]
connect_bd_net [get_bd_pins xlconstant_0/dout] [get_bd_pins axi_hwicap_0/eos_in] [get_bd_pins xDMA_SUBSYS/usr_irq_req]
connect_bd_net -net xlslice_0_Dout [get_bd_pins axi_gpio_0/gpio_io_o] \
  [get_bd_pins FROM_SH_AXI_LITE_NORTH/decouple] [get_bd_pins FROM_SH_AXI_MM_NORTH/aresetn1] \
  [get_bd_pins TO_SH_AXI_MM_NORTH/decouple] [get_bd_pins axi_gpio_0/gpio2_io_i]

# ---- address map ----
assign_bd_address -offset 0x0000000000000000 -range 64G -target_address_space [get_bd_addr_spaces S_AXI_MM_FROM_HLS_PR_NORTH] [get_bd_addr_segs ddr4_1/C0_DDR4_MEMORY_MAP/C0_DDR4_ADDRESS_BLOCK]
assign_bd_address -offset 0x0000000000000000 -range 128G -target_address_space [get_bd_addr_spaces xDMA_SUBSYS/xdma_0/M_AXI] [get_bd_addr_segs M_AXI_MM_TO_HLS_PR_NORTH/Reg]
assign_bd_address -offset 0x00010000 -range 64K -target_address_space [get_bd_addr_spaces xDMA_SUBSYS/xdma_0/M_AXI_LITE] [get_bd_addr_segs axi_gpio_0/S_AXI/Reg]
assign_bd_address -offset 0x00020000 -range 64K -target_address_space [get_bd_addr_spaces xDMA_SUBSYS/xdma_0/M_AXI_LITE] [get_bd_addr_segs clk_wiz_PROG/s_axi_lite/Reg]
assign_bd_address -offset 0x00030000 -range 64K -target_address_space [get_bd_addr_spaces xDMA_SUBSYS/xdma_0/M_AXI_LITE] [get_bd_addr_segs axi_hwicap_0/S_AXI_LITE/Reg]
assign_bd_address -offset 0x00050000 -range 64K -target_address_space [get_bd_addr_spaces xDMA_SUBSYS/xdma_0/M_AXI_LITE] [get_bd_addr_segs system_management_wiz_0/S_AXI_LITE/Reg]
assign_bd_address -offset 0x00070000 -range 64K -target_address_space [get_bd_addr_spaces xDMA_SUBSYS/xdma_0/M_AXI_LITE] [get_bd_addr_segs axi_gpio_KER_ACTIVE_COUNT/S_AXI/Reg]
assign_bd_address -offset 0x00080000 -range 64K -target_address_space [get_bd_addr_spaces xDMA_SUBSYS/xdma_0/M_AXI_LITE] [get_bd_addr_segs axi_gpio_status/S_AXI/Reg]
assign_bd_address -offset 0x000E0000 -range 64K -target_address_space [get_bd_addr_spaces xDMA_SUBSYS/xdma_0/M_AXI_LITE] [get_bd_addr_segs ddr4_1/C0_DDR4_MEMORY_MAP_CTRL/C0_REG]
assign_bd_address -offset 0x000F0000 -range 8K -target_address_space [get_bd_addr_spaces xDMA_SUBSYS/xdma_0/M_AXI_LITE] [get_bd_addr_segs axi_bram_ctrl_0/S_AXI/Mem0]
assign_bd_address -offset 0x00100000 -range 1M -target_address_space [get_bd_addr_spaces xDMA_SUBSYS/xdma_0/M_AXI_LITE] [get_bd_addr_segs M_AXI_LITE_TO_HLS_PR_NORTH/Reg]

validate_bd_design
save_bd_design
